# Altium schematic sheet System_VoltageControl.SchDoc
size 541 x 447 mm; Origin: Eagle
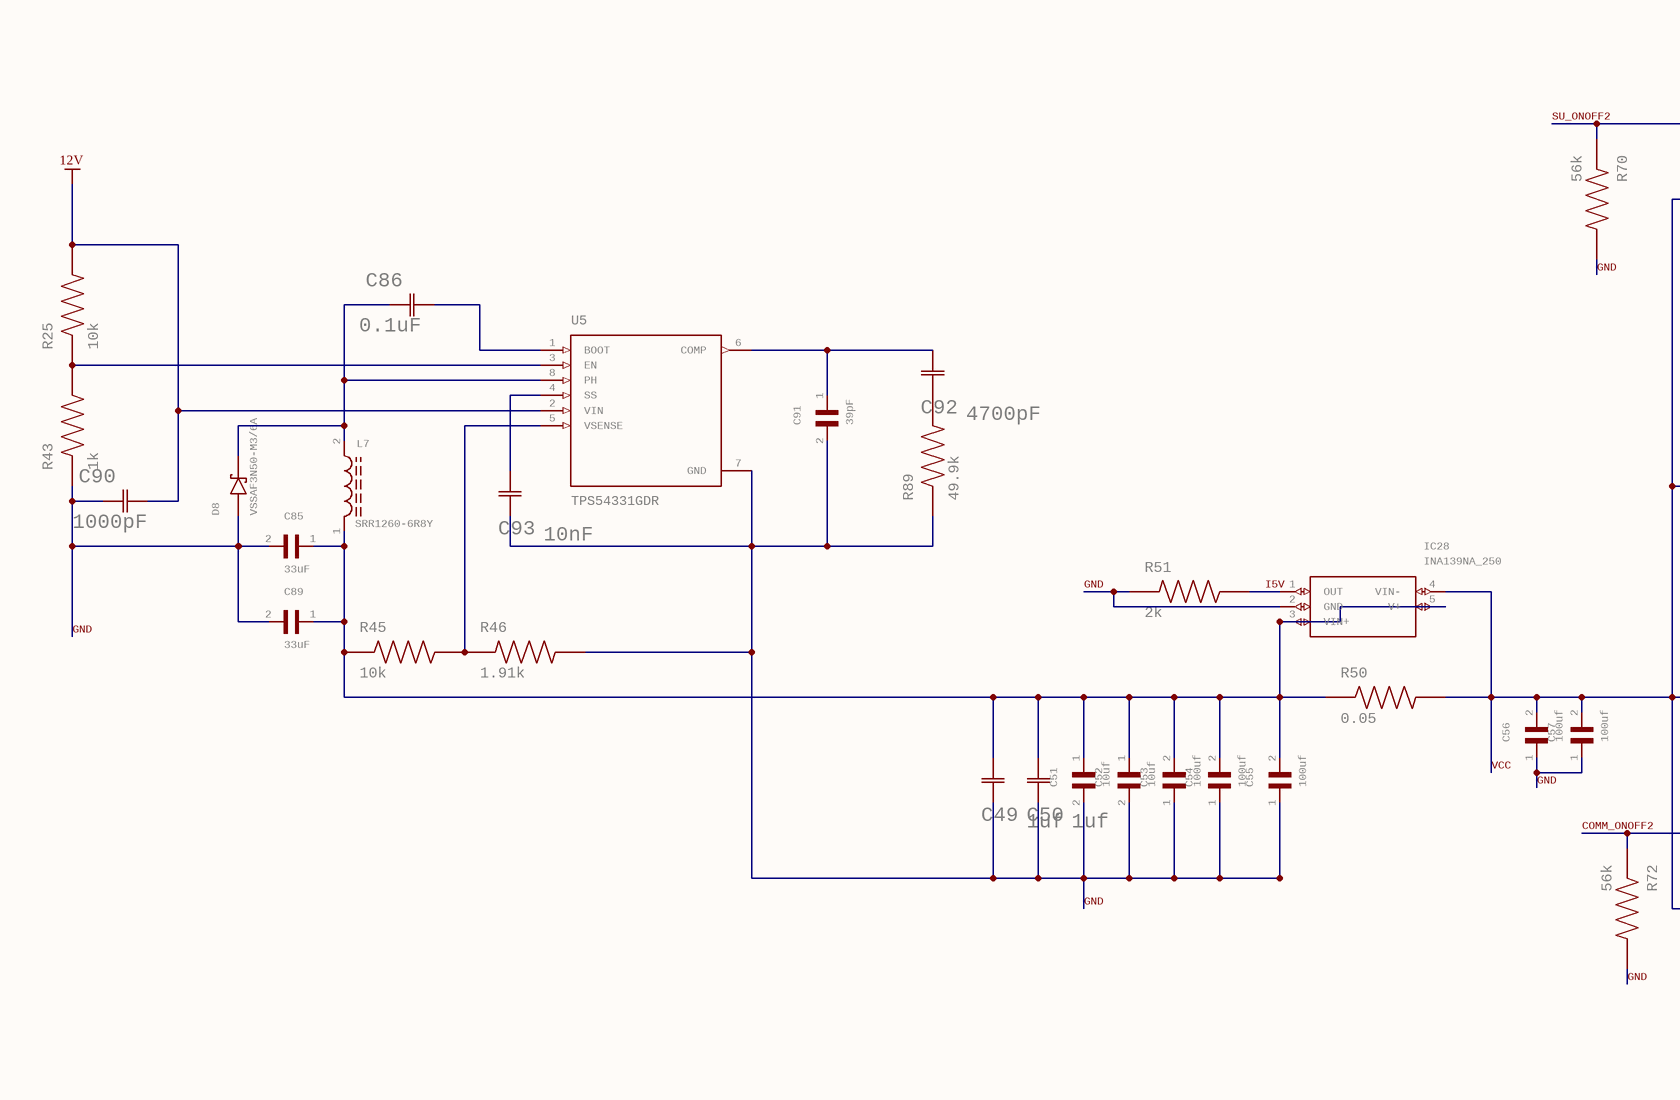
[diagram p0: System_VoltageControl.SchDoc, top left]
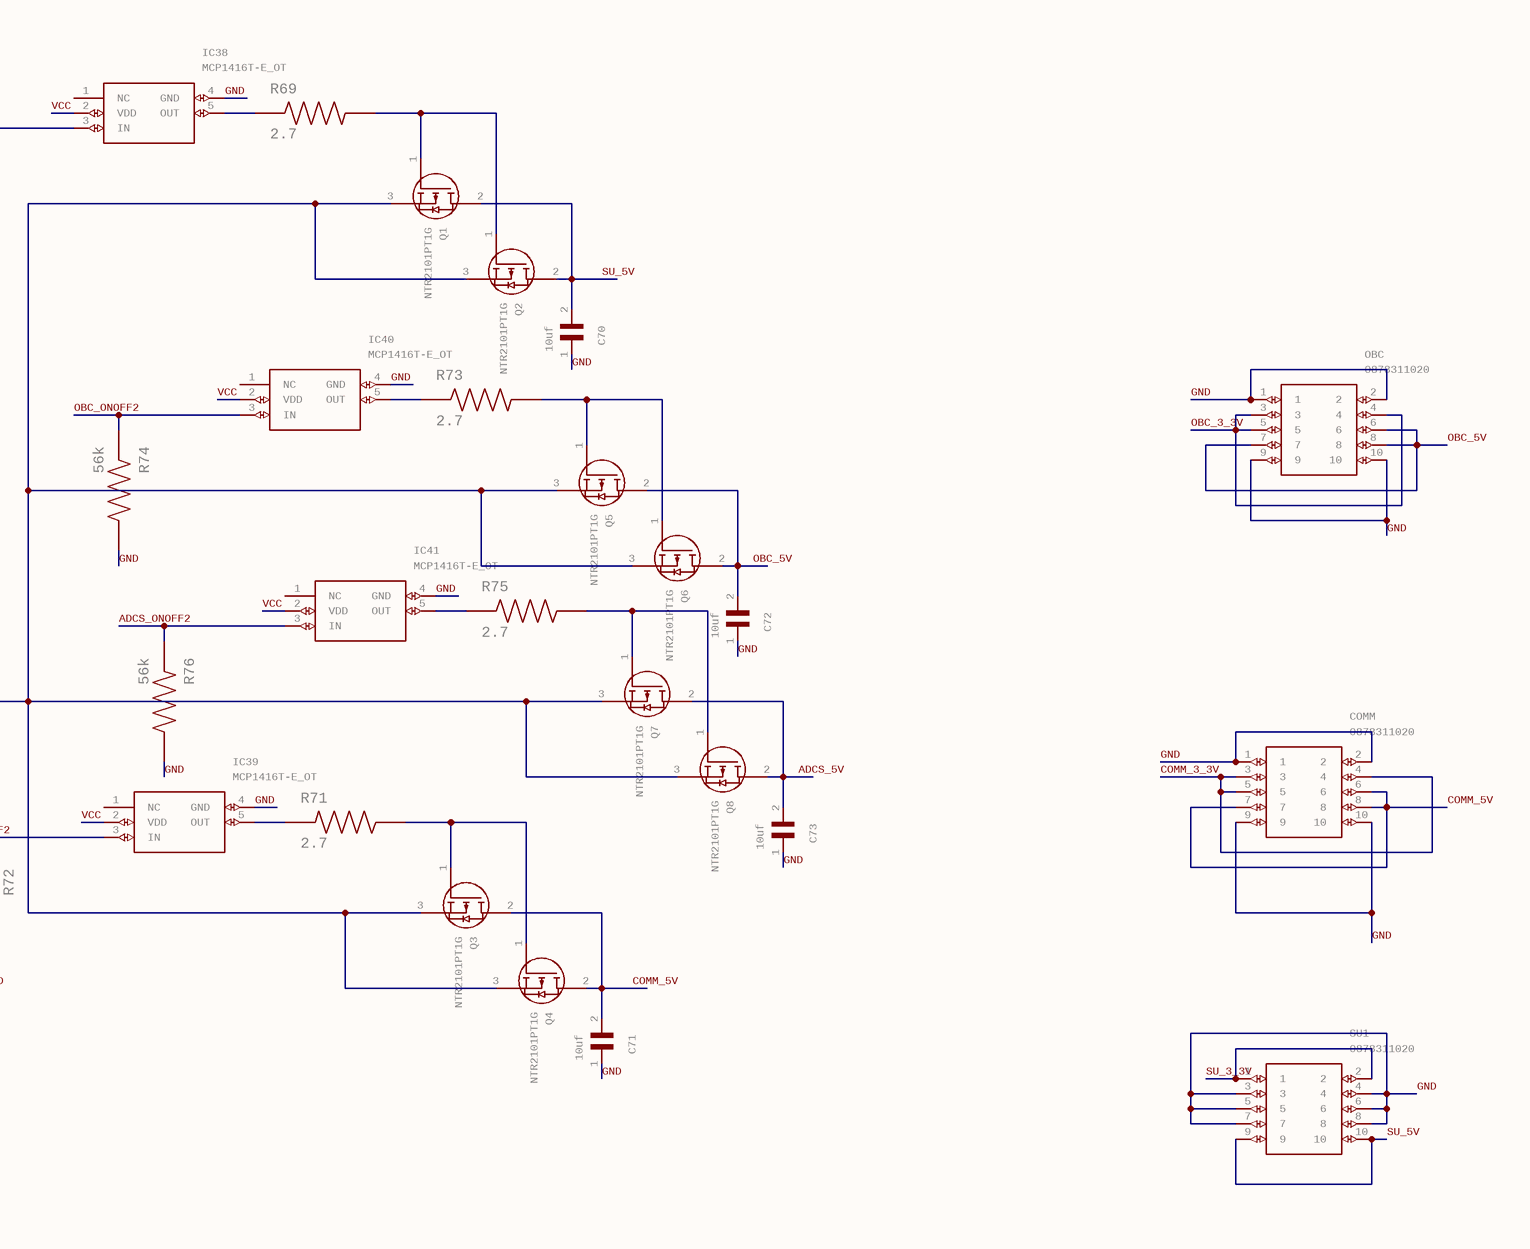
[diagram p1: System_VoltageControl.SchDoc, top right]
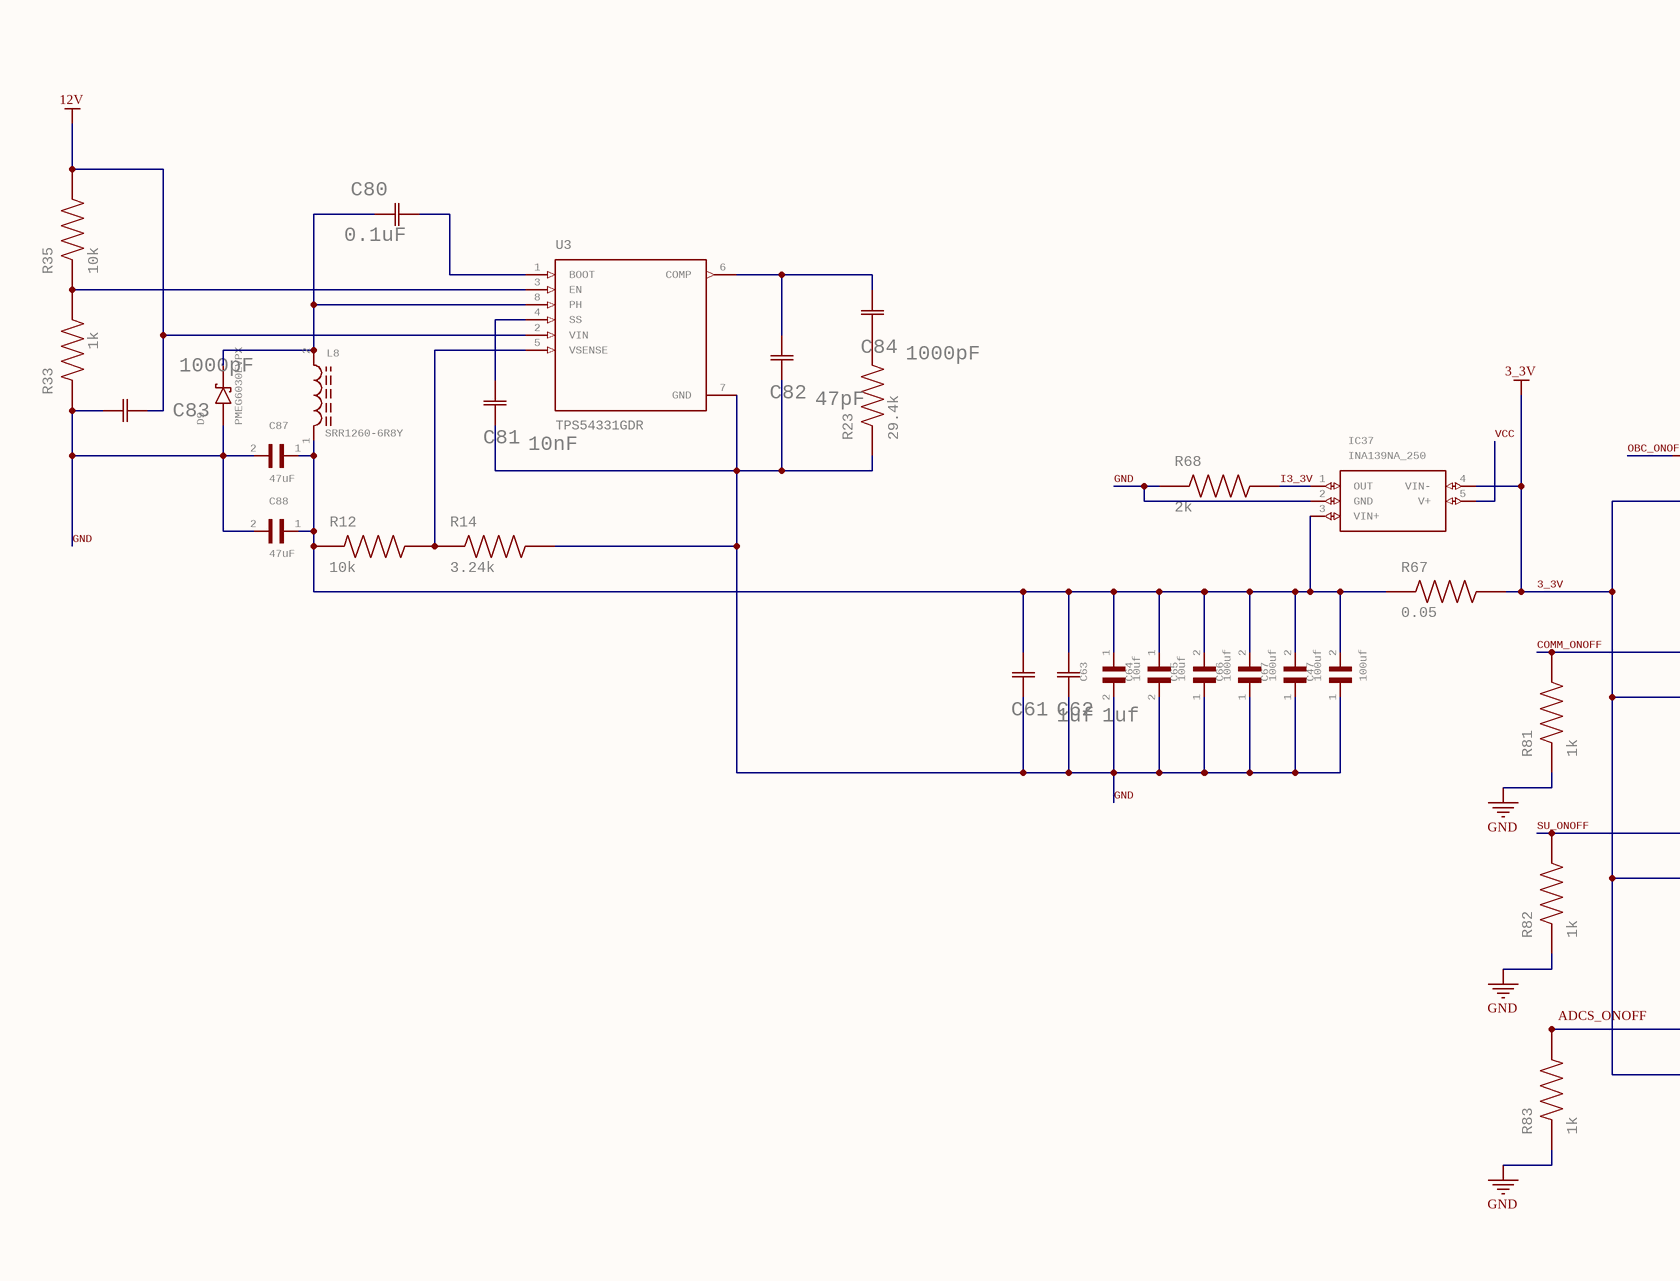
[diagram p2: System_VoltageControl.SchDoc, bottom left]
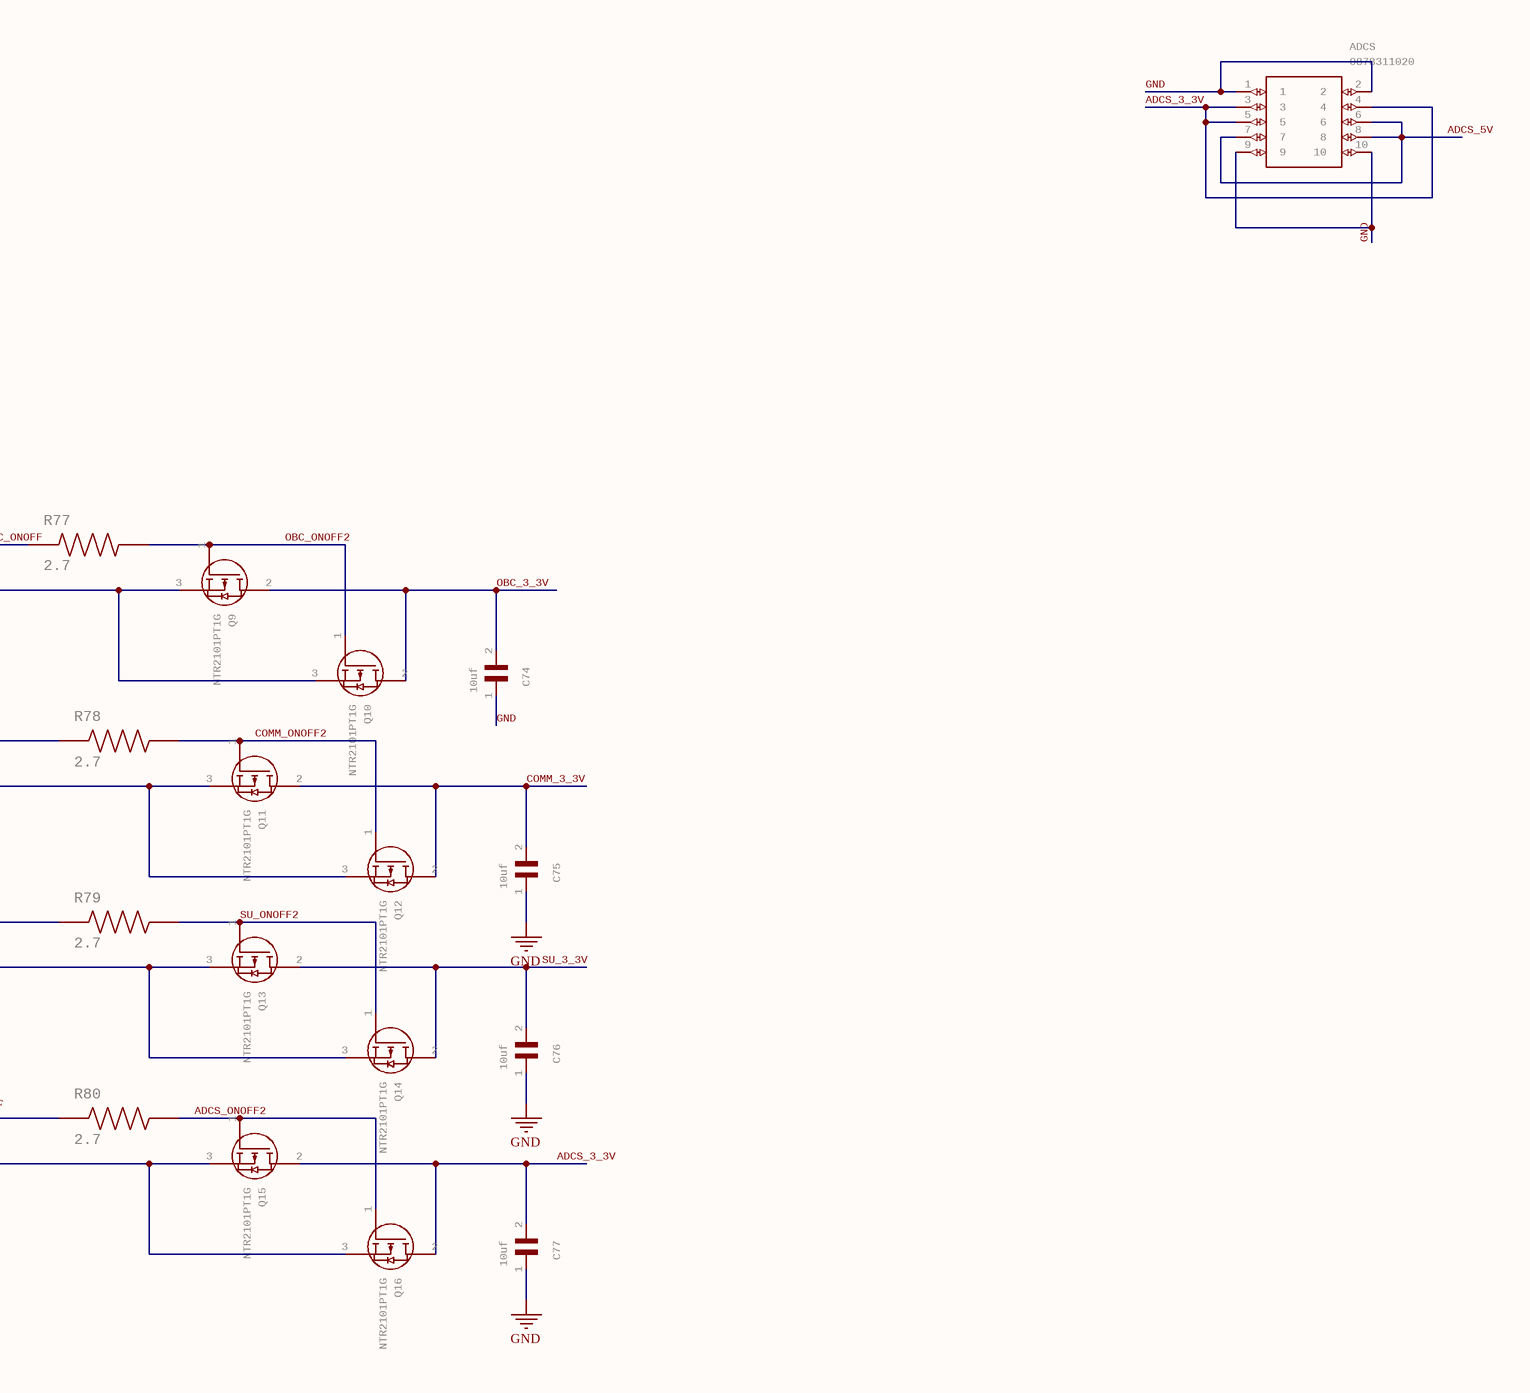
[diagram p3: System_VoltageControl.SchDoc, bottom right]

## Parts
ADCS  0878311020  [SHDR10W55P200_2X5_1265X630X640]
C47  100uf  [CAPC3225X280N]
C49  1uf  [YAG_CC0603_YAG]
C50  1uf  [YAG_CC0603_YAG]
C51  10uf  [CAPC2012X70]
C52  10uf  [CAPC2012X70]
C53  100uf  [CAPC3225X280N]
C54  100uf  [CAPC3225X280N]
C55  100uf  [CAPC3225X280N]
C56  100uf  [CAPC3225X280N]
C57  100uf  [CAPC3225X280N]
C61  1uf  [YAG_CC0603_YAG]
C62  1uf  [YAG_CC0603_YAG]
C63  10uf  [CAPC2012X70]
C64  10uf  [CAPC2012X70]
C65  100uf  [CAPC3225X280N]
C66  100uf  [CAPC3225X280N]
C67  100uf  [CAPC3225X280N]
C70  10uf  [CAPC2012X70]
C71  10uf  [CAPC2012X70]
C72  10uf  [CAPC2012X70]
C73  10uf  [CAPC2012X70]
C74  10uf  [CAPC2012X70]
C75  10uf  [CAPC2012X70]
C76  10uf  [CAPC2012X70]
C77  10uf  [CAPC2012X70]
C80  0.1uF  [CC0603N_YAG]
C81  10nF  [CC0603N_YAG]
C82  47pF  [CC0603N_YAG]
C83  1000pF  [CC0603N_YAG]
C84  1000pF  [CC0603N_YAG]
C85  33uF  [CAPC2012X70]
C86  0.1uF  [CC0603N_YAG]
C87  47uF  [CAPC2012X70]
C88  47uF  [CAPC2012X70]
C89  33uF  [CAPC2012X70]
C90  1000pF  [CC0603N_YAG]
C91  39pF  [CAPC2012X70]
C92  4700pF  [CC0603N_YAG]
C93  10nF  [CC0603N_YAG]
COMM  0878311020  [SHDR10W55P200_2X5_1265X630X640]
D8  VSSAF3N50-M3/6A  [DIOM5226X100N]
D9  PMEG6030EVPX  [DIO_PMEG6030EVPX]
IC28  INA139NA_250  [SOT95P280X145-5N]
IC37  INA139NA_250  [SOT95P280X145-5N]
IC38  MCP1416T-E_OT  [SOT95P270X145-5N]
IC39  MCP1416T-E_OT  [SOT95P270X145-5N]
IC40  MCP1416T-E_OT  [SOT95P270X145-5N]
IC41  MCP1416T-E_OT  [SOT95P270X145-5N]
L7  SRR1260-6R8Y  [INDP125125X600N]
L8  SRR1260-6R8Y  [INDP125125X600N]
OBC  0878311020  [SHDR10W55P200_2X5_1265X630X640]
Q1  NTR2101PT1G  [SOT96P237X111-3N]
Q2  NTR2101PT1G  [SOT96P237X111-3N]
Q3  NTR2101PT1G  [SOT96P237X111-3N]
Q4  NTR2101PT1G  [SOT96P237X111-3N]
Q5  NTR2101PT1G  [SOT96P237X111-3N]
Q6  NTR2101PT1G  [SOT96P237X111-3N]
Q7  NTR2101PT1G  [SOT96P237X111-3N]
Q8  NTR2101PT1G  [SOT96P237X111-3N]
Q9  NTR2101PT1G  [SOT96P237X111-3N]
Q10  NTR2101PT1G  [SOT96P237X111-3N]
Q11  NTR2101PT1G  [SOT96P237X111-3N]
Q12  NTR2101PT1G  [SOT96P237X111-3N]
Q13  NTR2101PT1G  [SOT96P237X111-3N]
Q14  NTR2101PT1G  [SOT96P237X111-3N]
Q15  NTR2101PT1G  [SOT96P237X111-3N]
Q16  NTR2101PT1G  [SOT96P237X111-3N]
R12  10k  [RESC1608X55N]
R14  3.24k  [RESC1608X55N]
R23  29.4k  [RESC1608X55N]
R25  10k  [RESC1608X55N]
R33  1k  [RESC1608X55N]
R35  10k  [RESC1608X55N]
R43  1k  [RESC1608X55N]
R45  10k  [RESC1608X55N]
R46  1.91k  [RESC1608X55N]
R50  0.05  [RESC1608X55N]
R51  2k  [RESC1608X55N]
R67  0.05  [RESC1608X55N]
R68  2k  [RESC1608X55N]
R69  2.7  [RESC1608X55N]
R70  56k  [RESC1608X55N]
R71  2.7  [RESC1608X55N]
R72  56k  [RESC1608X55N]
R73  2.7  [RESC1608X55N]
R74  56k  [RESC1608X55N]
R75  2.7  [RESC1608X55N]
R76  56k  [RESC1608X55N]
R77  2.7  [RESC1608X55N]
R78  2.7  [RESC1608X55N]
R79  2.7  [RESC1608X55N]
R80  2.7  [RESC1608X55N]
R81  1k  [RESC1608X55N]
R82  1k  [RESC1608X55N]
R83  1k  [RESC1608X55N]
R89  49.9k  [RESC1608X55N]
SU1  0878311020  [SHDR10W55P200_2X5_1265X630X640]
U3  TPS54331GDR  [SOIC127P599X175-8N]
U5  TPS54331GDR  [SOIC127P599X175-8N]

## Nets
3_3V: IC37.4(VIN-) Q9.3(D) Q10.3(D) Q11.3(D) Q12.3(D) Q13.3(D) Q14.3(D) Q15.3(D) Q16.3(D) R67.2
12V: C83.1 C90.2 R25.2 R35.2 U3.2(VIN) U5.2(VIN)
GND: ADCS.1 ADCS.2 ADCS.9 ADCS.10 C47.1 C49.1 C50.1 C51.2 C52.2 C53.1 C54.1 C55.1 C56.1 C57.1 C61.1 C62.1 C63.2 C64.2 C65.1 C66.1 C67.1 C70.1 C71.1 C72.1 C73.1 C74.1 C75.1 C76.1 C77.1 C81.1 C82.1 C83.2 C85.2 C87.2 C88.2 C89.2 C90.1 C91.2 C93.1 COMM.1 COMM.2 COMM.9 COMM.10 D8.A D9.2(A) IC28.2(GND) IC37.2(GND) IC38.4(GND) IC39.4(GND) IC40.4(GND) IC41.4(GND) OBC.1 OBC.2 OBC.9 OBC.10 R14.2 R23.1 R33.1 R43.1 R46.2 R51.1 R68.1 R70.2 R72.2 R74.2 R76.2 R81.1 R82.1 R83.1 R89.1 SU1.3 SU1.4 SU1.5 SU1.6 SU1.7 SU1.8 U3.7(GND) U5.7(GND)
ADCS_3_3V: ADCS.3 ADCS.4 ADCS.5 C77.2 Q15.2(S) Q16.2(S)
ADCS_5V: ADCS.6 ADCS.7 ADCS.8 C73.2 Q7.2(S) Q8.2(S)
ADCS_ONOFF2: IC41.3(IN) Q15.1(G) Q16.1(G) R76.1 R80.2
COMM_3_3V: C75.2 COMM.3 COMM.4 COMM.5 Q11.2(S) Q12.2(S)
COMM_5V: C71.2 COMM.6 COMM.7 COMM.8 Q3.2(S) Q4.2(S)
COMM_ONOFF: R78.1 R81.2
COMM_ONOFF2: IC39.3(IN) Q11.1(G) Q12.1(G) R72.1 R78.2
I3_3V: IC37.1(OUT) R68.2
I5V: IC28.1(OUT) R51.2
OBC_3_3V: C74.2 OBC.3 OBC.4 OBC.5 Q9.2(S) Q10.2(S)
OBC_5V: C72.2 OBC.6 OBC.7 OBC.8 Q5.2(S) Q6.2(S)
OBC_ONOFF: R77.1
OBC_ONOFF2: IC40.3(IN) Q9.1(G) Q10.1(G) R74.1 R77.2
SU_3_3V: C76.2 Q13.2(S) Q14.2(S) SU1.1 SU1.2
SU_5V: C70.2 Q1.2(S) Q2.2(S) SU1.9 SU1.10
SU_ONOFF: R79.1 R82.2
SU_ONOFF2: IC38.3(IN) Q13.1(G) Q14.1(G) R70.1 R79.2
VCC: C56.2 C57.2 IC28.4(VIN-) IC37.5(V+) IC38.2(VDD) IC39.2(VDD) IC40.2(VDD) IC41.2(VDD) Q1.3(D) Q2.3(D) Q3.3(D) Q4.3(D) Q5.3(D) Q6.3(D) Q7.3(D) Q8.3(D) R50.2
NetC47_2: C47.2 C61.2 C62.2 C63.1 C64.1 C65.2 C66.2 C67.2 C87.1 C88.1 IC37.3(VIN+) L8.1 R12.1 R67.1
NetC49_2: C49.2 C50.2 C51.1 C52.1 C53.2 C54.2 C55.2 C85.1 C89.1 IC28.3(VIN+) IC28.5(V+) L7.1 R45.1 R50.1
NetC80_1: C80.1 D9.1(K) L8.2 U3.8(PH)
NetC80_2: C80.2 U3.1(BOOT)
NetC81_2: C81.2 U3.4(SS)
NetC82_2: C82.2 C84.2 U3.6(COMP)
NetC84_1: C84.1 R23.2
NetC86_1: C86.1 D8.C(K) L7.2 U5.8(PH)
NetC86_2: C86.2 U5.1(BOOT)
NetC91_1: C91.1 C92.2 U5.6(COMP)
NetC92_1: C92.1 R89.2
NetC93_2: C93.2 U5.4(SS)
NetIC38_5: IC38.5(OUT) R69.1
NetIC39_5: IC39.5(OUT) R71.1
NetIC40_5: IC40.5(OUT) R73.1
NetIC41_5: IC41.5(OUT) R75.1
NetQ1_1: Q1.1(G) Q2.1(G) R69.2
NetQ3_1: Q3.1(G) Q4.1(G) R71.2
NetQ5_1: Q5.1(G) Q6.1(G) R73.2
NetQ7_1: Q7.1(G) Q8.1(G) R75.2
NetR12_2: R12.2 R14.1 U3.5(VSENSE)
NetR25_1: R25.1 R43.2 U5.3(EN)
NetR33_2: R33.2 R35.1 U3.3(EN)
NetR45_2: R45.2 R46.1 U5.5(VSENSE)
NetR80_1: R80.1 R83.2

Not connected (* = marked no-connect by the designer): IC38 1(NC); IC39 1(NC); IC40 1(NC); IC41 1(NC)

## Notes on the sheet
- Labels drawn without touching a wire or pin: ADCS_ONOFF

## Library data of the parts
ADCS COMM OBC SU1 = 0878311020: Headers & Wire Housings 2.00MM HDR 02X05P VT TH 15AU   Source:  Datasheet; MANUFACTURER_NAME: Molex; GateName_1: G$1; SymbolName_1: 0878311020; LibraryName: 0878311020; DeviceSetName: 0878311020; ARROW_PART_NUMBER: 0878311020; ARROW_PRICE-STOCK: https://www.arrow.com/en/products/0878311020/molex; HEIGHT: 6.4mm; MANUFACTURER_PART_NUMBER: 0878311020; MOUSER_PART_NUMBER: N/A; MOUSER_PRICE-STOCK: https://www.mouser.co.uk/ProductDetail/Molex/0878311020?qs=PBcRNPEHKsp4n%252By2XJ%252BEjQ%3D%3D
C47 C53-C57 C65-C67 = C1210C107M4PAC7800: GateName_1: G$1; MF: KEMET; SymbolName_1: C1210C107M4PAC7800; LibraryName: Cap 100uf 16v; DeviceSetName: C1210C107M4PAC7800; DIGI-KEY_PART_NUMBER: DIGI-KEY_PART_NUMBER; MP: C1210C107M4PAC7800; PACKAGE: 3225 KEMET
C49 C50 C61 C62 = CC0603KRX7R7BB105: GateName_1: A; SymbolName_1: CAPH; BUILT_BY: EMA_UL_Team; SOURCELIBRARY: Yageo_2014-12-31; VENDOR: Yageo; LibraryName: Cap 1uf; DeviceSetName: CC0603KRX7R7BB105; MANUFACTURER_PART_NUMBER: CC0603KRX7R7BB105
C51 C52 C63 C64 C70-C77 C85 C87-C89 C91 = CC0805KKX5R7BB106: KC 10ÂµF 0805 10% 16V X5R; GateName_1: G$1; MF: Yageo; SymbolName_1: CC0805KKX5R7BB106; LibraryName: Cap 10uf; DeviceSetName: CC0805KKX5R7BB106; DIGI-KEY_PART_NUMBER: 311-1865-1-ND; MP: CC0805KKX5R7BB106; PACKAGE: 0805 Yageo
C80-C84 C86 C90 C92 C93 = CC0603KRX7R7BB104: GateName_1: A; SymbolName_1: CAPH; BUILT_BY: EMA_UL_Team; SOURCELIBRARY: Yageo_2008-01-01_ChipCaps1; VENDOR: Yageo; LibraryName: Cap 0.1uf; DeviceSetName: CC0603KRX7R7BB104; MANUFACTURER_PART_NUMBER: CC0603KRX7R7BB104
D8 = VSSAF3N50-M3/6A: Diode Schottky 50V 3A 2-Pin DO-221AC Plastic T/R Check prices; GateName_1: G$1; MF: Vishay Semiconductor; SymbolName_1: VSSAF3N50-M3/6A; LibraryName: VSSAF3N50-M3_6A; DeviceSetName: VSSAF3N50-M3/6A; AVAILABILITY: In Stock; MP: VSSAF3N50-M3/6A; PACKAGE: DO-221AC-221 Vishay Semiconductor Diodes Division; PRICE: None; PURCHASE-URL: https://pricing.snapeda.com/search/part/VSSAF3N50-M3/6A/?ref=eda
D9 = PMEG6030EVPX: PMEG6030 Series 60 V 3 A Surface Mount Schottky Barrier Rectifier - SOD-128 Check prices; GateName_1: G$1; MF: Nexperia USA; SymbolName_1: PMEG6030EVPX; LibraryName: PMEG6030EVPX; DeviceSetName: PMEG6030EVPX; AVAILABILITY: In Stock; MP: PMEG6030EVPX; PACKAGE: CFP5-2 Nexperia USA Inc.; PRICE: None; PURCHASE-URL: https://pricing.snapeda.com/search/part/PMEG6030EVPX/?ref=eda
IC28 IC37 = INA139NA_250: 36V, High-Side, High-Speed, Current Output Current Sense Amplifier   Source:  Datasheet; MANUFACTURER_NAME: Texas Instruments; MANUFACTURER_PART_NUMBER: INA139NA/250; GateName_1: G$1; SymbolName_1: INA139NA_250; LibraryName: INA139NA_250; DeviceSetName: INA139NA_250; ARROW_PART_NUMBER: INA139NA/250; ARROW_PRICE-STOCK: https://www.arrow.com/en/products/ina139na250/texas-instruments; HEIGHT: 1.45mm; MOUSER_PART_NUMBER: 595-INA139NA/250; MOUSER_PRICE-STOCK: https://www.mouser.co.uk/ProductDetail/Texas-Instruments/INA139NA-250?qs=VBduBm9rCJQSYOixXF05Zw%3D%3D
IC38-IC41 = MCP1416T-E_OT: MOSFET Driver 1.5A High-Speed 18V SOT23   Source:  Datasheet; MANUFACTURER_NAME: Microchip; MANUFACTURER_PART_NUMBER: MCP1416T-E/OT; GateName_1: G$1; SymbolName_1: MCP1416T-E_OT; LibraryName: MCP1416T-E_OT; DeviceSetName: MCP1416T-E_OT; ARROW_PART_NUMBER: MCP1416T-E/OT; ARROW_PRICE-STOCK: https://www.arrow.com/en/products/mcp1416t-eot/microchip-technology; HEIGHT: 1.45mm; MOUSER_PART_NUMBER: 579-MCP1416T-E/OT; MOUSER_PRICE-STOCK: https://www.mouser.co.uk/ProductDetail/Microchip-Technology/MCP1416T-E-OT?qs=hH%252BOa0VZEiBT%252BgAjATFU6A%3D%3D
L7 L8 = SRR1260-150M: Inductor Power Shielded Wirewound 33uH 20% 100KHz 27Q-Factor Ferrite 3A 60mOhm DCR T/R Check prices; GateName_1: G$1; MF: Bourns; SymbolName_1: SRR1260-150M; LibraryName: SRR1260-150M; DeviceSetName: SRR1260-150M; AVAILABILITY: In Stock; MP: SRR1260-150M; PACKAGE: Nonstandard Bourns; PRICE: None; PURCHASE-URL: https://pricing.snapeda.com/search/part/SRR1260-150M/?ref=eda
Q1-Q16 = NTR2101PT1G: Small Signal MOSFET   Source:  Datasheet; MANUFACTURER_NAME: ON Semiconductor; GateName_1: G$1; SymbolName_1: NTR2101PT1G; LibraryName: MOSFET-P; DeviceSetName: NTR2101PT1G; ARROW_PART_NUMBER: NTR2101PT1G; ARROW_PRICE-STOCK: https://www.arrow.com/en/products/ntr2101pt1g/on-semiconductor; HEIGHT: 1.11mm; MANUFACTURER_PART_NUMBER: NTR2101PT1G; MOUSER_PART_NUMBER: 863-NTR2101PT1G; MOUSER_PRICE-STOCK: https://www.mouser.co.uk/ProductDetail/ON-Semiconductor/NTR2101PT1G?qs=ZXBb0xZ9WeAElbwG%2FHcx4g%3D%3D
R12 R14 R23 R25 R33 R35 R43 R45 R46 R69 R71 R73 R75 R77-R80 R89 = RL0816S-2R7-F: GateName_1: G$1; MF: Susumu; SymbolName_1: RL0816S-2R7-F; LibraryName: Res1-2.7; DeviceSetName: RL0816S-2R7-F; DIGI-KEY_PART_NUMBER: DIGI-KEY_PART_NUMBER; MP: RL0816S-2R7-F; PACKAGE: 1608 Susumu
R50 R67 = ERJ-L03KJ50MV: RES SMD 0.05 OHM 5% 1/5W 0603; GateName_1: G$1; MF: Panasonic; SymbolName_1: ERJ-L03KJ50MV; LibraryName: Res1 0.05; DeviceSetName: ERJ-L03KJ50MV; DIGI-KEY_PART_NUMBER: P50NJCT-ND; MP: ERJ-L03KJ50MV; PACKAGE: 1608-2 Panasonic
R51 R68 = ERJ-PB3D2001V: Res Thick Film 0603 2K Ohm 5% 0.2W(1/5W) Â±50ppm/C Pad SMD Automotive T/R; GateName_1: G$1; MF: Panasonic; SymbolName_1: ERJ-PB3D2001V; LibraryName: Res1 2k; DeviceSetName: ERJ-PB3D2001V; DIGI-KEY_PART_NUMBER: P20315CT-ND; MP: ERJ-PB3D2001V; PACKAGE: 1608 Panasonic Electronic Components
R70 R72 R74 R76 = ERJ-PB3D5602V: RES SMD 56K OHM 0.5% 1/5W 0603; GateName_1: G$1; MF: Panasonic; SymbolName_1: ERJ-PB3D5602V; LibraryName: Res1 56k; DeviceSetName: ERJ-PB3D5602V; DIGI-KEY_PART_NUMBER: DIGI-KEY_PART_NUMBER; MP: ERJ-PB3D5602V; PACKAGE: 1608 Panasonic Electronic Components
R81-R83 = ERJ-PB3D1001V: Res Thick Film 0603 1K Ohm 5% 0.2W(1/5W) Â±50ppm/C Pad SMD Automotive T/R; GateName_1: G$1; MF: Panasonic; SymbolName_1: ERJ-PB3D1001V; LibraryName: Res1 1k; DeviceSetName: ERJ-PB3D1001V; DIGI-KEY_PART_NUMBER: P20283CT-ND; MP: ERJ-PB3D1001V; PACKAGE: 1608 Panasonic Electronic Components
U3 U5 = TPS54331GDR: Check prices; GateName_1: A; MF: Texas Instruments; SymbolName_1: TPS54331GDR; LibraryName: TPS54331GDR; DeviceSetName: TPS54331GDR; AVAILABILITY: In Stock; MP: TPS54331GDR; PACKAGE: SOIC-8 Texas Instruments; PRICE: None; PURCHASE-URL: https://pricing.snapeda.com/search/part/TPS54331GDR/?ref=eda